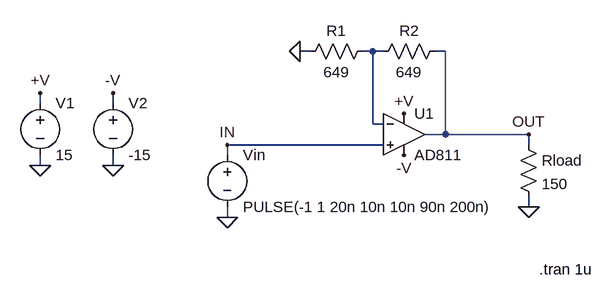
[diagram p0: schematic AD811.asc]
AD811.asc, the LTspice schematic file:
Version 4
SHEET 1 1240 700
WIRE 432 -1232 416 -1232
WIRE 528 -1232 512 -1232
WIRE 544 -1232 528 -1232
WIRE 640 -1232 624 -1232
WIRE 16 -1152 16 -1168
WIRE 128 -1152 128 -1168
WIRE 528 -1120 528 -1232
WIRE 544 -1120 528 -1120
WIRE 640 -1104 640 -1232
WIRE 640 -1104 608 -1104
WIRE 768 -1104 640 -1104
WIRE 544 -1088 304 -1088
WIRE 768 -1088 768 -1104
WIRE 304 -1072 304 -1088
WIRE 16 -1056 16 -1072
WIRE 128 -1056 128 -1072
WIRE 768 -992 768 -1008
WIRE 304 -976 304 -992
FLAG 304 -976 0
FLAG 768 -1104 OUT
FLAG 304 -1088 IN
FLAG 576 -1136 +V
FLAG 576 -1072 -V
FLAG 416 -1232 0
FLAG 768 -992 0
FLAG 16 -1168 +V
FLAG 16 -1056 0
FLAG 128 -1168 -V
FLAG 128 -1056 0
SYMBOL voltage 304 -1088 R0
WINDOW 123 24 146 Left 2
WINDOW 39 24 125 Left 2
SYMATTR InstName Vin
SYMATTR Value PULSE(-1 1 20n 10n 10n 90n 200n)
SYMBOL res 528 -1248 R90
WINDOW 0 0 56 VBottom 2
WINDOW 3 32 56 VTop 2
SYMATTR InstName R1
SYMATTR Value 649
SYMBOL res 640 -1248 R90
WINDOW 0 0 56 VBottom 2
WINDOW 3 32 56 VTop 2
SYMATTR InstName R2
SYMATTR Value 649
SYMBOL Opamps\\AD811 576 -1168 R0
SYMATTR InstName U1
SYMBOL res 752 -1104 R0
SYMATTR InstName Rload
SYMATTR Value 150
SYMBOL voltage 16 -1168 R0
WINDOW 123 0 0 Left 2
WINDOW 39 0 0 Left 2
SYMATTR InstName V1
SYMATTR Value 15
SYMBOL voltage 128 -1168 R0
WINDOW 123 24 146 Left 2
WINDOW 39 24 125 Left 2
SYMATTR InstName V2
SYMATTR Value -15
TEXT 784 -896 Left 2 !.tran 1u

The netlist it stands for:
* AD811.asc
Vin IN 0 PULSE(-1 1 20n 10n 10n 90n 200n)
R1 N001 0 649
R2 OUT N001 649
XU1 IN N001 +V -V OUT AD811  ; pins In+ In- V+ V- OUT
Rload OUT 0 150
V1 +V 0 15
V2 -V 0 -15
.tran 1u
.backanno
.end